# EAGLE schematic PCB2 (EAGLE 9.6.2)

## Sheet 1 of 2: CONEXIONES
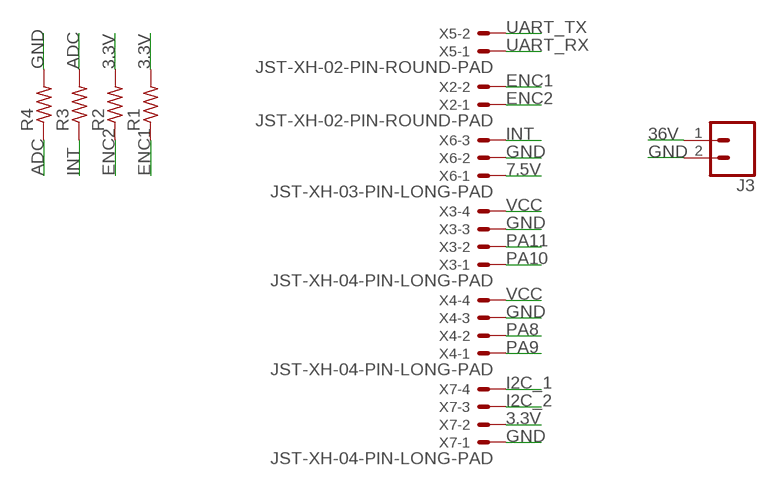
[diagram p0: schematic, sheet 1]

### Parts
J3  CONN_025MM  [SCREWTERMINAL-5MM-2]
R1  R-US_0207/10  [0207/10]
R2  R-US_0207/10  [0207/10]
R3  R-US_0207/10  [0207/10]
R4  R-US_0207/10  [0207/10]
X2  JST-XH-02-PIN-ROUND-PAD  [JST-XH-02-PACKAGE-ROUND-PAD]
X3  JST-XH-04-PIN-LONG-PAD  [JST-XH-04-PACKAGE-LONG-PAD]
X4  JST-XH-04-PIN-LONG-PAD  [JST-XH-04-PACKAGE-LONG-PAD]
X5  JST-XH-02-PIN-ROUND-PAD  [JST-XH-02-PACKAGE-ROUND-PAD]
X6  JST-XH-03-PIN-LONG-PAD  [JST-XH-03-PACKAGE-LONG-PAD]
X7  JST-XH-04-PIN-LONG-PAD  [JST-XH-04-PACKAGE-LONG-PAD]

### Nets
3.3V: R1.2 R2.2 X7.2 ; also sheet 2
7.5V: X6.1 ; also sheet 2
36V: J3.1 ; also sheet 2
ADC: R3.2 R4.1 ; also sheet 2
ENC1: R1.1 X2.2 ; also sheet 2
ENC2: R2.1 X2.1 ; also sheet 2
GND: J3.2 R4.2 X3.3 X4.3 X6.2 X7.1 ; also sheet 2
I2C_1: X7.4 ; also sheet 2
I2C_2: X7.3 ; also sheet 2
INT: R3.1 X6.3
PA8: X4.2 ; also sheet 2
PA9: X4.1 ; also sheet 2
PA10: X3.1 ; also sheet 2
PA11: X3.2 ; also sheet 2
UART_RX: X5.1 ; also sheet 2
UART_TX: X5.2 ; also sheet 2
VCC: X3.4 X4.4 ; also sheet 2

## Sheet 2 of 2: STM32 | REGULADORES
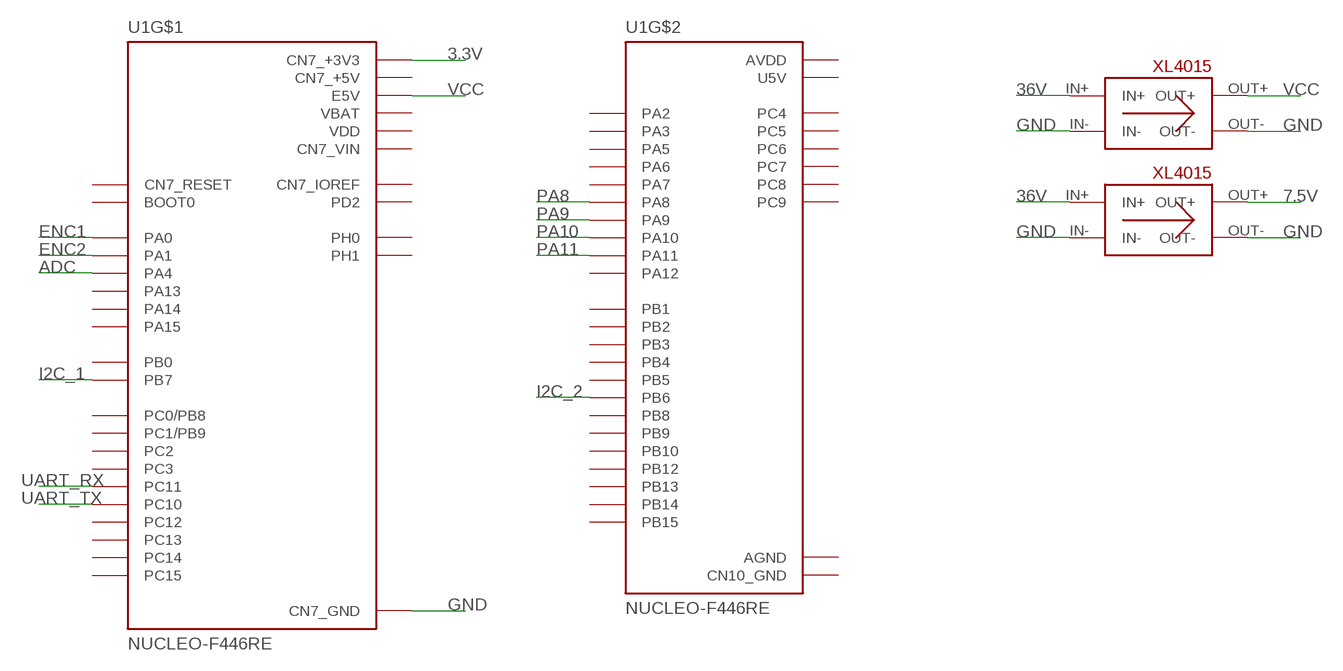
[diagram p1: schematic, sheet 2]

### Parts
U1  NUCLEO-F446RE  [MODULE_NUCLEO-F446RE]
U$1  XL4015  [XL4015]
U$4  XL4015  [XL4015]

### Nets
3.3V: U1.CN7_16(CN7_+3V3) ; also sheet 1
7.5V: U$1.OUT+ ; also sheet 1
36V: U$1.IN+ U$4.IN+ ; also sheet 1
ADC: U1.CN7_32(PA4) ; also sheet 1
ENC1: U1.CN7_28(PA0) ; also sheet 1
ENC2: U1.CN7_30(PA1) ; also sheet 1
GND: U1.CN7_8(CN7_GND) U1.CN7_19(CN7_GND) U1.CN7_20(CN7_GND) U1.CN7_22(CN7_GND) U$1.IN- U$1.OUT- U$4.IN- U$4.OUT- ; also sheet 1
I2C_1: U1.CN7_21(PB7) ; also sheet 1
I2C_2: U1.CN10_17(PB6) ; also sheet 1
PA8: U1.CN10_23(PA8) ; also sheet 1
PA9: U1.CN10_21(PA9) ; also sheet 1
PA10: U1.CN10_33(PA10) ; also sheet 1
PA11: U1.CN10_14(PA11) ; also sheet 1
UART_RX: U1.CN7_2(PC11) ; also sheet 1
UART_TX: U1.CN7_1(PC10) ; also sheet 1
VCC: U1.CN7_6(E5V) U$4.OUT+ ; also sheet 1
Unconnected: U1.CN7_3(PC12) U1.CN7_4(PD2) U1.CN7_7(BOOT0) U1.CN7_12(CN7_IOREF) U1.CN7_13(PA13) U1.CN7_14(CN7_RESET) U1.CN7_15(PA14) U1.CN7_17(PA15) U1.CN7_23(PC13) U1.CN7_25(PC14) U1.CN7_27(PC15) U1.CN7_29(PH0) U1.CN7_31(PH1) U1.CN7_34(PB0) U1.CN7_35(PC2) U1.CN7_36(PC1/PB9) U1.CN7_37(PC3) U1.CN7_38(PC0/PB8) U1.CN10_1(PC9) U1.CN10_2(PC8) U1.CN10_3(PB8) U1.CN10_4(PC6) U1.CN10_5(PB9) U1.CN10_6(PC5) U1.CN10_11(PA5) U1.CN10_12(PA12) U1.CN10_13(PA6) U1.CN10_15(PA7) U1.CN10_16(PB12) U1.CN10_19(PC7) U1.CN10_22(PB2) U1.CN10_24(PB1) U1.CN10_25(PB10) U1.CN10_26(PB15) U1.CN10_27(PB4) U1.CN10_28(PB14) U1.CN10_29(PB5) U1.CN10_30(PB13) U1.CN10_31(PB3) U1.CN10_34(PC4) U1.CN10_35(PA2) U1.CN10_37(PA3)

## Power pins joined to a net without a drawn wire
AGND: U1.CN10_32(AGND)
AVDD: U1.CN10_7(AVDD)
CN7_+5V: U1.CN7_18(CN7_+5V)
CN7_VIN: U1.CN7_24(CN7_VIN)
CN10_GND: U1.CN10_9(CN10_GND) U1.CN10_20(CN10_GND)
U5V: U1.CN10_8(U5V)
VBAT: U1.CN7_33(VBAT)
VDD: U1.CN7_5(VDD)

## Library data of the parts
J3 = SparkFun-Connectors:CONN_02: Multi connection point. Often used as Generic Header-pin footprint for 0.1 inch spaced/style header connections On any of the 0.1 inch spaced packages, you can populate with these: Break Away Headers - Straight <https://www.sparkfun.com/products/116> (PRT-00116) Break Away Male Headers - Right Angle <https://www.sparkfun.com/products/553> (PRT-00553) Female Headers <https://www.sparkfun.com/products/115> (PRT-00115) Break Away Headers - Machine Pin <https://www.sparkfun.com/products/117> (PRT-00117) Break Away Female Headers - Swiss Machine Pin <https://www.sparkfun.com/products/743> (PRT-00743) For SCREWTERMINALS and SPRING TERMINALS visit here: Screw Terimnals on SparkFun.com <https://www.sparkfun.com/search/results?term=Screw+Terminals> (5mm/3.5mm/2.54mm spacing) This device is also useful as a general connection point to wire up your design to another part of your project. Our various solder wires solder well into these plated through hole pads. Hook-Up Wire - Assortment (Stranded, 22 AWG) <https://www.sparkfun.com/products/11375> (PRT-11375) Hook-Up Wire - Assortment (Solid Core, 22 AWG) <https://www.sparkfun.com/products/11367> (PRT-11367) View the entire wire category on our website here <https://www.sparkfun.com/categories/141> Special notes: Molex polarized connector foot print use with: PRT-08233 with associated crimp pins and housings. 2.54_SCREWTERM for use with PRT-10571. 3.5mm Screw Terminal footprints for PRT-08084 5mm Screw Terminal footprints for use with PRT-08432; SF_SKU: PRT-08432
R1-R4 = resistor:R-US_: RESISTOR, American symbol
U1 = NUCLEO-F446RE:NUCLEO-F446RE: STM32 Nucleo-64 development board with STM32F446RET6 MCU, supports Arduino and ST morpho connectivity Check availability <https://pricing.snapeda.com/parts/NUCLEO-F446RE/STMicroelectronics/view-part?ref=eda>; AVAILABILITY: In Stock; CHECK_PRICES: https://www.snapeda.com/parts/NUCLEO-F446RE/STMicroelectronics/view-part/?ref=eda; DESCRIPTION: STM32F446RE, mbed-Enabled Development Nucleo-64 STM32F4 ARM® Cortex®-M4 MCU 32-Bit Embedded Evaluation Board; MF: STMicroelectronics; MP: NUCLEO-F446RE; PACKAGE: None; PRICE: None; PURCHASE-URL: https://www.snapeda.com/api/url_track_click_mouser/?unipart_id=284290&manufacturer=STMicroelectronics&part_name=NUCLEO-F446RE&search_term=None; SNAPEDA_LINK: https://www.snapeda.com/parts/NUCLEO-F446RE/STMicroelectronics/view-part/?ref=snap
U$1 U$4 = ReguladorXI4015:XL4015
X2 X5 = Rembrandt Electronics - JST XH Connectors v1-0:JST-XH-02-PIN: JST XH Connector 2 Pin Wire to board connector. Pitch: 2,54 mm, (0.100") Number of pins: 2 Created by Rembrandt Electronics www.rembrandtelectronics.com
X3 X4 X7 = Rembrandt Electronics - JST XH Connectors v1-0:JST-XH-04-PIN: JST XH Connector 2 Pin Wire to board connector. Pitch: 2,54 mm, (0.100") Number of pins: 4 Created by Rembrandt Electronics www.rembrandtelectronics.com
X6 = Rembrandt Electronics - JST XH Connectors v1-0:JST-XH-03-PIN: JST XH Connector 2 Pin Wire to board connector. Pitch: 2,54 mm, (0.100") Number of pins: 3 Created by Rembrandt Electronics www.rembrandtelectronics.com